# EAGLE schematic civ_if1 (EAGLE 7.7.0)
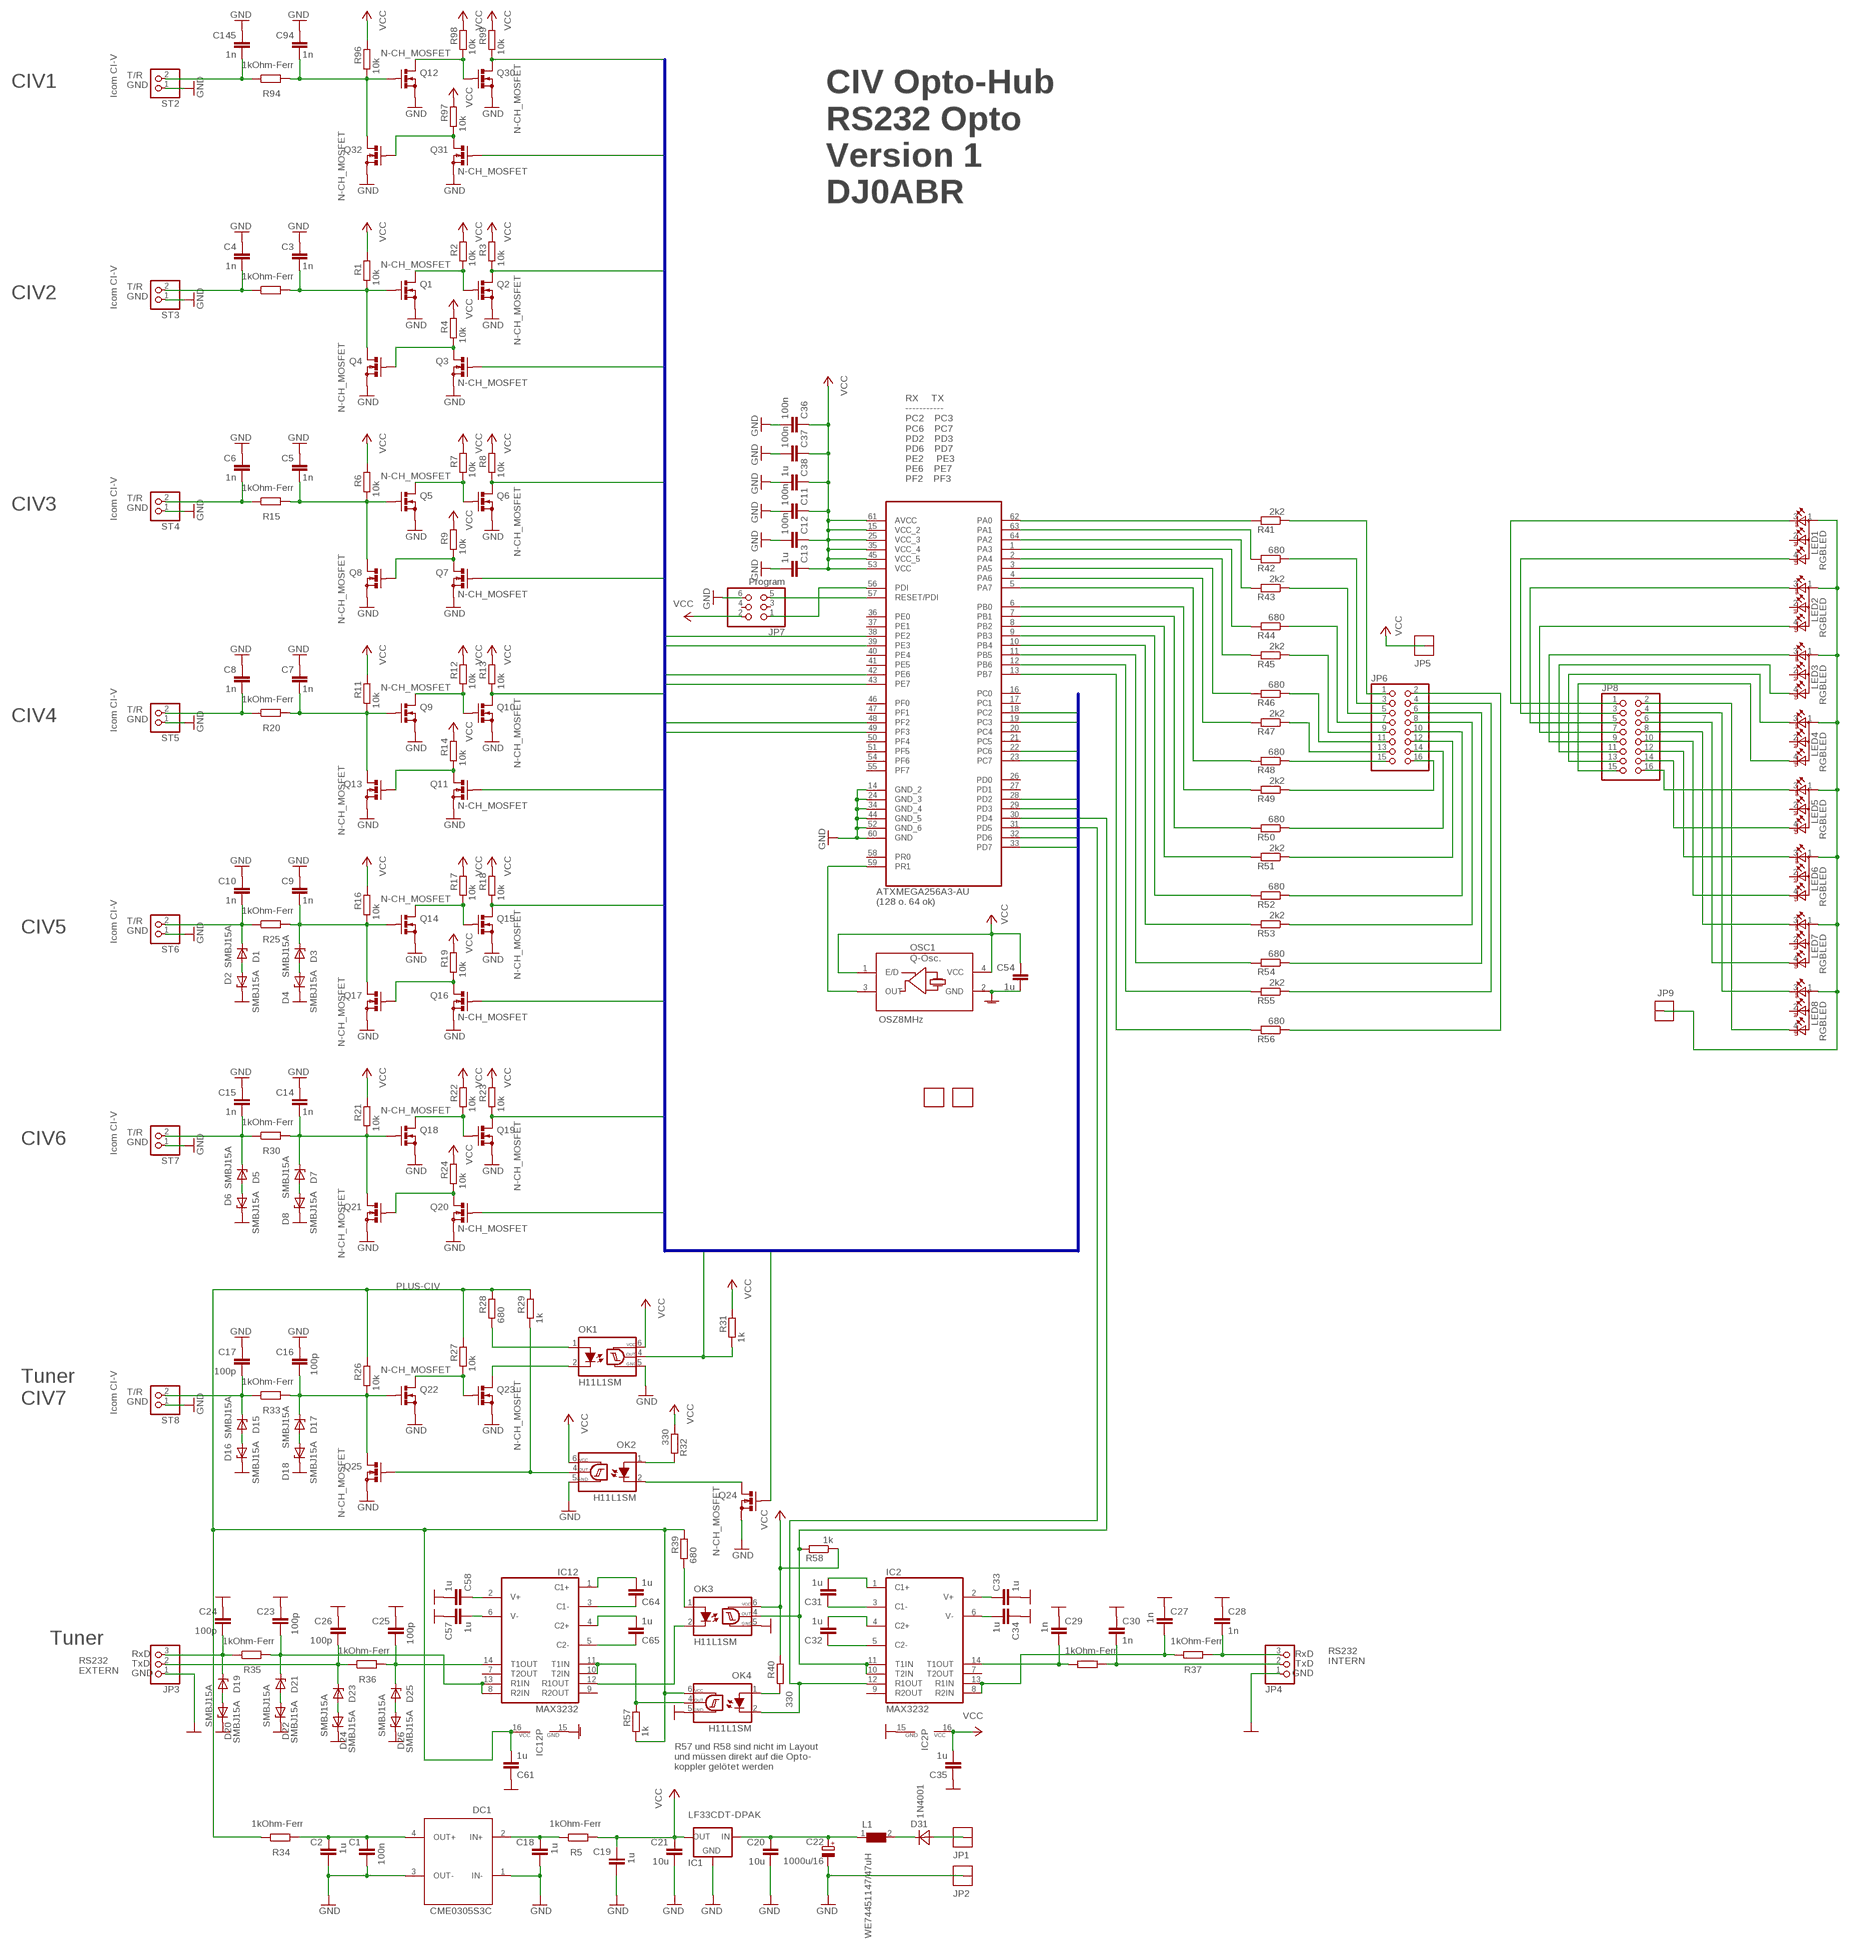
[diagram p0: schematic, sheet 1]

## Parts
C1  100n  C-EUC0603  [C0603]
C2  1u  C-EUC0603  [C0603]
C3  1n  C-EUC0603  [C0603]
C4  1n  C-EUC0603  [C0603]
C5  1n  C-EUC0603  [C0603]
C6  1n  C-EUC0603  [C0603]
C7  1n  C-EUC0603  [C0603]
C8  1n  C-EUC0603  [C0603]
C9  1n  C-EUC0603  [C0603]
C10  1n  C-EUC0603  [C0603]
C11  100n  C-EUC0603  [C0603]
C12  100n  C-EUC0603  [C0603]
C13  1u  C-EUC0603  [C0603]
C14  1n  C-EUC0603  [C0603]
C15  1n  C-EUC0603  [C0603]
C16  100p  C-EUC0603  [C0603]
C17  100p  C-EUC0603  [C0603]
C18  1u  C-EUC0603  [C0603]
C19  1u  C-EUC0603  [C0603]
C20  10u  C-EUC0805  [C0805]
C21  10u  C-EUC0603  [C0603]
C22  1000u/16  CPOL-EUE5-13  [E5-13]
C23  100p  C-EUC0603  [C0603]
C24  100p  C-EUC0603  [C0603]
C25  100p  C-EUC0603  [C0603]
C26  100p  C-EUC0603  [C0603]
C27  1n  C-EUC0603  [C0603]
C28  1n  C-EUC0603  [C0603]
C29  1n  C-EUC0603  [C0603]
C30  1n  C-EUC0603  [C0603]
C31  1u  C-EUC0603K  [C0603K]
C32  1u  C-EUC0603K  [C0603K]
C33  1u  C-EUC0603K  [C0603K]
C34  1u  C-EUC0603K  [C0603K]
C35  1u  C-EUC0603  [C0603]
C36  100n  C-EUC0603  [C0603]
C37  100n  C-EUC0603  [C0603]
C38  1u  C-EUC0603  [C0603]
C54  1u  C-EUC0603K  [C0603K]
C57  1u  C-EUC0603K  [C0603K]
C58  1u  C-EUC0603K  [C0603K]
C61  1u  C-EUC0603  [C0603]
C64  1u  C-EUC0603K  [C0603K]
C65  1u  C-EUC0603K  [C0603K]
C94  1n  C-EUC0603  [C0603]
C145  1n  C-EUC0603  [C0603]
D1  SMBJ15A  ZPYSMA  [SMA]
D2  SMBJ15A  ZPYSMA  [SMA]
D3  SMBJ15A  ZPYSMA  [SMA]
D4  SMBJ15A  ZPYSMA  [SMA]
D5  SMBJ15A  ZPYSMA  [SMA]
D6  SMBJ15A  ZPYSMA  [SMA]
D7  SMBJ15A  ZPYSMA  [SMA]
D8  SMBJ15A  ZPYSMA  [SMA]
D15  SMBJ15A  ZPYSMA  [SMA]
D16  SMBJ15A  ZPYSMA  [SMA]
D17  SMBJ15A  ZPYSMA  [SMA]
D18  SMBJ15A  ZPYSMA  [SMA]
D19  SMBJ15A  ZPYSMA  [SMA]
D20  SMBJ15A  ZPYSMA  [SMA]
D21  SMBJ15A  ZPYSMA  [SMA]
D22  SMBJ15A  ZPYSMA  [SMA]
D23  SMBJ15A  ZPYSMA  [SMA]
D24  SMBJ15A  ZPYSMA  [SMA]
D25  SMBJ15A  ZPYSMA  [SMA]
D26  SMBJ15A  ZPYSMA  [SMA]
D31  1N4001  DIODE_GROSSSMD  [MELF]
DC1  CME0305S3C  CME_MURATA_DCDCCME  [MURATA_DCDC]
FID1  FIDUCIAL  [FIDUCIAL]
FID2  FIDUCIAL  [FIDUCIAL]
IC1  LF33CDT-DPAK  LP2950CDT-5.0  [DPACK]
IC2  MAX3232  MAX3232CSE  [SO16]
IC12  MAX3232  MAX3232CSE  [SO16]
JP1  THICKPINSQUARE  [THICKPIN]
JP2  THICKPINSQUARE  [THICKPIN]
JP3  PINHD-1X3  [1X03]
JP4  PINHD-1X3  [1X03]
JP5  THICKPINSQUARE  [THICKPIN]
JP6  PINHD-2X8  [2X08]
JP7  Program  PINHD-2X3  [2X03]
JP8  PINHD-2X8  [2X08]
JP9  THICKPINSQUARE  [THICKPIN]
L1  WE74451147/47uH  WE-PD3-74451147_S  [S]
LED1  RGBLED  LED_RGB_WE  [PLCC4_WE_LED]
LED2  RGBLED  LED_RGB_WE  [PLCC4_WE_LED]
LED3  RGBLED  LED_RGB_WE  [PLCC4_WE_LED]
LED4  RGBLED  LED_RGB_WE  [PLCC4_WE_LED]
LED5  RGBLED  LED_RGB_WE  [PLCC4_WE_LED]
LED6  RGBLED  LED_RGB_WE  [PLCC4_WE_LED]
LED7  RGBLED  LED_RGB_WE  [PLCC4_WE_LED]
LED8  RGBLED  LED_RGB_WE  [PLCC4_WE_LED]
OK1  H11L1SM  H11L1MS  [DIL6-SMD]
OK2  H11L1SM  H11L1MS  [DIL6-SMD]
OK3  H11L1SM  H11L1MS  [DIL6-SMD]
OK4  H11L1SM  H11L1MS  [DIL6-SMD]
OSC1  OSZ8MHz  QOSC_AURELAURIS7050  [QOSC_AQO7015]
Q1  N-CH_MOSFET  BS170_SMD  [SOT23]
Q2  N-CH_MOSFET  BS170_SMD  [SOT23]
Q3  N-CH_MOSFET  BS170_SMD  [SOT23]
Q4  N-CH_MOSFET  BS170_SMD  [SOT23]
Q5  N-CH_MOSFET  BS170_SMD  [SOT23]
Q6  N-CH_MOSFET  BS170_SMD  [SOT23]
Q7  N-CH_MOSFET  BS170_SMD  [SOT23]
Q8  N-CH_MOSFET  BS170_SMD  [SOT23]
Q9  N-CH_MOSFET  BS170_SMD  [SOT23]
Q10  N-CH_MOSFET  BS170_SMD  [SOT23]
Q11  N-CH_MOSFET  BS170_SMD  [SOT23]
Q12  N-CH_MOSFET  BS170_SMD  [SOT23]
Q13  N-CH_MOSFET  BS170_SMD  [SOT23]
Q14  N-CH_MOSFET  BS170_SMD  [SOT23]
Q15  N-CH_MOSFET  BS170_SMD  [SOT23]
Q16  N-CH_MOSFET  BS170_SMD  [SOT23]
Q17  N-CH_MOSFET  BS170_SMD  [SOT23]
Q18  N-CH_MOSFET  BS170_SMD  [SOT23]
Q19  N-CH_MOSFET  BS170_SMD  [SOT23]
Q20  N-CH_MOSFET  BS170_SMD  [SOT23]
Q21  N-CH_MOSFET  BS170_SMD  [SOT23]
Q22  N-CH_MOSFET  BS170_SMD  [SOT23]
Q23  N-CH_MOSFET  BS170_SMD  [SOT23]
Q24  N-CH_MOSFET  BS170_SMD  [SOT23]
Q25  N-CH_MOSFET  BS170_SMD  [SOT23]
Q30  N-CH_MOSFET  BS170_SMD  [SOT23]
Q31  N-CH_MOSFET  BS170_SMD  [SOT23]
Q32  N-CH_MOSFET  BS170_SMD  [SOT23]
R1  10k  R-EU_R0603  [R0603]
R2  10k  R-EU_R0603  [R0603]
R3  10k  R-EU_R0603  [R0603]
R4  10k  R-EU_R0603  [R0603]
R5  1kOhm-Ferr  R-EU_R0603  [R0603]
R6  10k  R-EU_R0603  [R0603]
R7  10k  R-EU_R0603  [R0603]
R8  10k  R-EU_R0603  [R0603]
R9  10k  R-EU_R0603  [R0603]
R10  1kOhm-Ferr  R-EU_R0603  [R0603]
R11  10k  R-EU_R0603  [R0603]
R12  10k  R-EU_R0603  [R0603]
R13  10k  R-EU_R0603  [R0603]
R14  10k  R-EU_R0603  [R0603]
R15  1kOhm-Ferr  R-EU_R0603  [R0603]
R16  10k  R-EU_R0603  [R0603]
R17  10k  R-EU_R0603  [R0603]
R18  10k  R-EU_R0603  [R0603]
R19  10k  R-EU_R0603  [R0603]
R20  1kOhm-Ferr  R-EU_R0603  [R0603]
R21  10k  R-EU_R0603  [R0603]
R22  10k  R-EU_R0603  [R0603]
R23  10k  R-EU_R0603  [R0603]
R24  10k  R-EU_R0603  [R0603]
R25  1kOhm-Ferr  R-EU_R0603  [R0603]
R26  10k  R-EU_R0603  [R0603]
R27  10k  R-EU_R0603  [R0603]
R28  680  R-EU_R0603  [R0603]
R29  1k  R-EU_R0603  [R0603]
R30  1kOhm-Ferr  R-EU_R0603  [R0603]
R31  1k  R-EU_R0603  [R0603]
R32  330  R-EU_R0603  [R0603]
R33  1kOhm-Ferr  R-EU_R0603  [R0603]
R34  1kOhm-Ferr  R-EU_R0603  [R0603]
R35  1kOhm-Ferr  R-EU_R0603  [R0603]
R36  1kOhm-Ferr  R-EU_R0603  [R0603]
R37  1kOhm-Ferr  R-EU_R0603  [R0603]
R38  1kOhm-Ferr  R-EU_R0603  [R0603]
R39  680  R-EU_R0603  [R0603]
R40  330  R-EU_R0603  [R0603]
R41  2k2  R-EU_R0603  [R0603]
R42  680  R-EU_R0603  [R0603]
R43  2k2  R-EU_R0603  [R0603]
R44  680  R-EU_R0603  [R0603]
R45  2k2  R-EU_R0603  [R0603]
R46  680  R-EU_R0603  [R0603]
R47  2k2  R-EU_R0603  [R0603]
R48  680  R-EU_R0603  [R0603]
R49  2k2  R-EU_R0603  [R0603]
R50  680  R-EU_R0603  [R0603]
R51  2k2  R-EU_R0603  [R0603]
R52  680  R-EU_R0603  [R0603]
R53  2k2  R-EU_R0603  [R0603]
R54  680  R-EU_R0603  [R0603]
R55  2k2  R-EU_R0603  [R0603]
R56  680  R-EU_R0603  [R0603]
R57  1k  R-EU_R0603  [R0603]
R58  1k  R-EU_R0603  [R0603]
R94  1kOhm-Ferr  R-EU_R0603  [R0603]
R96  10k  R-EU_R0603  [R0603]
R97  10k  R-EU_R0603  [R0603]
R98  10k  R-EU_R0603  [R0603]
R99  10k  R-EU_R0603  [R0603]
ST2  PINHEAD2X1SMALL  [PINHEAD1X2]
ST3  PINHEAD2X1SMALL  [PINHEAD1X2]
ST4  PINHEAD2X1SMALL  [PINHEAD1X2]
ST5  PINHEAD2X1SMALL  [PINHEAD1X2]
ST6  PINHEAD2X1SMALL  [PINHEAD1X2]
ST7  PINHEAD2X1SMALL  [PINHEAD1X2]
ST8  PINHEAD2X1SMALL  [PINHEAD1X2]
U1  ATXMEGA256A3-AU  [QFP80P1600X1600X120-64N]

## Nets
GND [Supply]: C1.2 C2.2 C3.1 C4.1 C5.1 C6.1 C7.1 C8.1 C9.1 C10.1 C11.2 C12.2 C13.2 C14.1 C15.1 C16.1 C17.1 C18.2 C19.2 C20.2 C21.2 C22.- C23.1 C24.1 C25.1 C26.1 C27.1 C28.1 C29.1 C30.1 C33.2 C34.1 C35.1 C36.2 C37.2 C38.2 C54.2 C57.1 C58.2 C61.1 C94.1 C145.1 D2.C D4.C D6.C D8.C D16.C D18.C D20.C D22.C D24.C D26.C DC1.1(IN-) DC1.3(OUT-) IC1.4(GND) IC2.15(GND) IC12.15(GND) JP2.1 JP3.1 JP4.1 JP7.6 OK1.5(GND) OK2.5(GND) OK3.5(GND) OK4.5(GND) OSC1.2(GND) Q1.2(S) Q2.2(S) Q3.2(S) Q4.2(S) Q5.2(S) Q6.2(S) Q7.2(S) Q8.2(S) Q9.2(S) Q10.2(S) Q11.2(S) Q12.2(S) Q13.2(S) Q14.2(S) Q15.2(S) Q16.2(S) Q17.2(S) Q18.2(S) Q19.2(S) Q20.2(S) Q21.2(S) Q22.2(S) Q23.2(S) Q24.2(S) Q25.2(S) Q30.2(S) Q31.2(S) Q32.2(S) ST2.1 ST3.1 ST4.1 ST5.1 ST6.1 ST7.1 ST8.1 U1.14(GND_2) U1.24(GND_3) U1.34(GND_4) U1.44(GND_5) U1.52(GND_6) U1.60(GND) ; supply symbol labelled 
N$1: OK1.2(C) Q23.3(D)
N$2: Q1.3(D) Q2.1(G) R2.1
N$3: OSC1.3(OUT) U1.59(PR1)
N$4: C1.1 C2.1 DC1.4(OUT+) R34.2
N$5: Q3.3(D) Q4.1(G) R4.1
N$6: C18.1 DC1.2(IN+) R5.1
N$7: C4.2 R10.1 ST3.2
N$8: OK2.1(A) R32.2
N$9: Q5.3(D) Q6.1(G) R7.1
N$10: C94.2 Q12.1(G) Q32.3(D) R94.2 R96.1
N$11: C3.2 Q1.1(G) Q4.3(D) R1.1 R10.2
N$12: Q7.3(D) Q8.1(G) R9.1
N$13: C6.2 R15.1 ST4.2
N$14: C5.2 Q5.1(G) Q8.3(D) R6.1 R15.2
N$15: C8.2 R20.1 ST5.2
N$16: Q9.3(D) Q10.1(G) R12.1
N$17: Q22.3(D) Q23.1(G) R27.1
N$18: OK2.4(OUT) Q25.1(G) R29.1
N$19: Q11.3(D) Q13.1(G) R14.1
N$20 [v12]: C20.1 C22.+ IC1.1(IN) L1.1
N$21: C7.2 Q9.1(G) Q13.3(D) R11.1 R20.2
N$22: C10.2 D1.C R25.1 ST6.2
N$23: Q14.3(D) Q15.1(G) R17.1
N$24: C9.2 D3.C Q14.1(G) Q17.3(D) R16.1 R25.2
N$25: C15.2 D5.C R30.1 ST7.2
N$26: Q16.3(D) Q17.1(G) R19.1
N$27: JP6.1 R41.1
N$28: C14.2 D7.C Q18.1(G) Q21.3(D) R21.1 R30.2
N$29: C17.2 D15.C R33.1 ST8.2
N$30: Q18.3(D) Q19.1(G) R22.1
N$31: C16.2 D17.C Q22.1(G) Q25.3(D) R26.1 R33.2
N$32: JP6.3 R42.1
N$33: Q20.3(D) Q21.1(G) R24.1
N$34 [Supply]: D31.2(A) JP1.1
N$35: D15.A D16.A
N$36: D17.A D18.A
N$37: C24.2 D19.C JP3.3 R35.1
N$38: C23.2 D21.C IC12.8(R2IN) IC12.13(R1IN) R35.2
N$39: D19.A D20.A
N$40: D21.A D22.A
N$41: C26.2 D23.C JP3.2 R36.1
N$42: C28.2 JP4.3 R37.1
N$43: D23.A D24.A
N$44: D25.A D26.A
N$45: C64.1 IC12.3(C1-)
N$46: C64.2 IC12.1(C1+)
N$47: C65.2 IC12.4(C2+)
N$48: C65.1 IC12.5(C2-)
N$49: C58.1 IC12.2(V+)
N$50: C57.2 IC12.6(V-)
N$51: IC12.10(T2IN) IC12.11(T1IN) OK4.4(OUT) R57.2
N$52: IC12.12(R1OUT) OK3.2(C)
N$53: C27.2 IC2.8(R2IN) IC2.13(R1IN) R37.2
N$54: C25.2 D25.C IC12.14(T1OUT) R36.2
N$55: JP6.5 R43.1
N$56: JP6.7 R44.1
N$57: C30.2 JP4.2 R38.1
N$58: JP6.9 R45.1
N$59: JP6.11 R46.1
N$60: C31.1 IC2.3(C1-)
N$61: C31.2 IC2.1(C1+)
N$62: C32.2 IC2.4(C2+)
N$63: C32.1 IC2.5(C2-)
N$64: C33.1 IC2.2(V+)
N$65: C34.2 IC2.6(V-)
N$66: IC2.10(T2IN) IC2.11(T1IN) OK3.4(OUT) R58.2 U1.30(PD4)
N$67: IC2.12(R1OUT) OK4.2(C) U1.31(PD5)
N$68: C29.2 IC2.14(T1OUT) R38.2
N$69: JP6.13 R47.1
N$70: OK3.1(A) R39.1
N$71: OK4.1(A) R40.1
N$72: JP6.15 R48.1
N$73: JP6.16 R49.1
N$74: JP6.14 R50.1
N$75: JP6.12 R51.1
N$76: JP6.10 R52.1
N$77: JP6.8 R53.1
N$78: JP6.6 R54.1
N$79: JP6.4 R55.1
N$80: JP6.2 R56.1
N$81: R41.2 U1.62(PA0)
N$82: R42.2 U1.63(PA1)
N$83: R43.2 U1.64(PA2)
N$84: R44.2 U1.1(PA3)
N$85: R45.2 U1.2(PA4)
N$86: R46.2 U1.3(PA5)
N$87: R47.2 U1.4(PA6)
N$88: R48.2 U1.5(PA7)
N$89: R49.2 U1.6(PB0)
N$90: R50.2 U1.7(PB1)
N$91: R51.2 U1.8(PB2)
N$92: R52.2 U1.9(PB3)
N$93: R53.2 U1.10(PB4)
N$94: R54.2 U1.11(PB5)
N$95 [v12]: D31.1(C) L1.2
N$96: R55.2 U1.12(PB6)
N$97: R56.2 U1.13(PB7)
N$98: D1.A D2.A
N$99: Q12.3(D) Q30.1(G) R98.1
N$100: JP7.5 U1.57(RESET/PDI)
N$101: JP7.1 U1.56(PDI)
N$102: D3.A D4.A
N$103: D5.A D6.A
N$104: D7.A D8.A
N$105: Q31.3(D) Q32.1(G) R97.1
N$106: C145.2 R94.1 ST2.2
N$107: OK2.2(C) Q24.3(D)
N$108: JP9.1 LED1.1(A2) LED2.1(A2) LED3.1(A2) LED4.1(A2) LED5.1(A2) LED6.1(A2) LED7.1(A2) LED8.1(A2)
N$109: JP8.1 LED1.3(CRED)
N$110: JP8.3 LED1.4(CGREEN)
N$111: JP8.5 LED2.3(CRED)
N$112: JP8.7 LED2.4(CGREEN)
N$113: JP8.9 LED3.3(CRED)
N$114: JP8.11 LED3.4(CGREEN)
N$115: JP8.13 LED4.3(CRED)
N$116: JP8.15 LED4.4(CGREEN)
N$117: JP8.16 LED5.3(CRED)
N$118: JP8.14 LED5.4(CGREEN)
N$119: JP8.12 LED6.3(CRED)
N$120: JP8.10 LED6.4(CGREEN)
N$121: JP8.8 LED7.3(CRED)
N$122: JP8.6 LED7.4(CGREEN)
N$123: JP8.4 LED8.3(CRED)
N$124: JP8.2 LED8.4(CGREEN)
PLUS-CIV [Supply]: C61.2 IC12.16(VCC) OK4.6(VCC) R26.2 R27.2 R28.2 R29.2 R34.1 R39.2 R57.1
UART1: Q30.3(D) R99.1 U1.18(PC2)
UART2: Q31.1(G) U1.19(PC3)
UART3: Q2.3(D) R3.1 U1.22(PC6)
UART4: Q3.1(G) U1.23(PC7)
UART5: Q6.3(D) R8.1 U1.28(PD2)
UART6: Q7.1(G) U1.29(PD3)
UART7: Q10.3(D) R13.1 U1.32(PD6)
UART8: Q11.1(G) U1.33(PD7)
UART9: Q15.3(D) R18.1 U1.38(PE2)
UART10: Q16.1(G) U1.39(PE3)
UART11: Q19.3(D) R23.1 U1.42(PE6)
UART12: Q20.1(G) U1.43(PE7)
UART13: OK1.4(OUT) R31.1 U1.48(PF2)
UART14: Q24.1(G) U1.49(PF3)
UART15: OK1.1(A) R28.1
VCC [Supply]: C11.1 C12.1 C13.1 C19.1 C21.1 C35.2 C36.1 C37.1 C38.1 C54.1 IC1.3(OUT) IC2.16(VCC) JP5.1 JP7.2 OK1.6(VCC) OK2.6(VCC) OK3.6(VCC) OSC1.1(E/D) OSC1.4(VCC) R1.2 R2.2 R3.2 R4.2 R5.2 R6.2 R7.2 R8.2 R9.2 R11.2 R12.2 R13.2 R14.2 R16.2 R17.2 R18.2 R19.2 R21.2 R22.2 R23.2 R24.2 R31.2 R32.1 R40.2 R58.1 R96.2 R97.2 R98.2 R99.2 U1.15(VCC_2) U1.25(VCC_3) U1.35(VCC_4) U1.45(VCC_5) U1.53(VCC) U1.61(AVCC)
Unconnected: FID1.P$1 FID2.P$1 IC2.7(T2OUT) IC2.9(R2OUT) IC12.7(T2OUT) IC12.9(R2OUT) JP7.3 JP7.4 LED1.2(CBLUE) LED2.2(CBLUE) LED3.2(CBLUE) LED4.2(CBLUE) LED5.2(CBLUE) LED6.2(CBLUE) LED7.2(CBLUE) LED8.2(CBLUE) U1.16(PC0) U1.17(PC1) U1.20(PC4) U1.21(PC5) U1.26(PD0) U1.27(PD1) U1.36(PE0) U1.37(PE1) U1.40(PE4) U1.41(PE5) U1.46(PF0) U1.47(PF1) U1.50(PF4) U1.51(PF5) U1.54(PF6) U1.55(PF7) U1.58(PR0)

## Buses
UART[1..14]

## Notes on the sheet
- T/R
- CIV1 | GND
- Icom CI-V
- CIV Opto-Hub
  RS232 Opto
  Version 1
  DJ0ABR
- T/R
- CIV2 | GND
- Icom CI-V
- RX     TX
  -----------
  PC2    PC3
  PC6    PC7
  PD2    PD3
  PD6    PD7 
  PE2     PE3
  PE6    PE7
  PF2    PF3
- T/R
- CIV3 | GND
- Icom CI-V
- T/R
- CIV4 | GND
- Icom CI-V
- ATXMEGA256A3-AU
  (128 o. 64 ok)
- T/R
- CIV5 | GND
- Icom CI-V
- T/R
- CIV6 | GND
- Icom CI-V
- T/R
- Tuner
  CIV7
- GND
- Icom CI-V
- Tuner
- RxD | RxD
- RS232
  INTERN
- TxD | TxD
- RS232
  EXTERN
- GND | GND
- R57 und R58 sind nicht im Layout
  und müssen direkt auf die Opto-
  koppler gelötet werden

## Library data of the parts
C1-C21 C23-C38 C54 C57 C58 C61 C64 C65 C94 C145 = rcl:C-EU: CAPACITOR, European symbol
C22 = rcl:CPOL-EU: POLARIZED CAPACITOR, European symbol
D1-D8 D15-D26 = km:ZPY: Z DIODE 1 W
D31 = km:DIODE_GROSS
DC1 = km:CME_MURATA_DCDC
FID1 FID2 = km:FIDUCIAL
IC1 = v-reg:LP2950?*: Source: http://cache.national.com/ds/LP/LP2950.pdf
IC2 IC12 = maxim:MAX3232*: True RS-232 Transceivers 3.0V to 5.5V, Low-Power up to 1Mbps, Using Four 0.1µF External Capacitors Source: http://pdfserv.maxim-ic.com/en/ds/MAX3222-MAX3241.pdf; MPN: MAX3232CSE; OC_FARNELL: 9725490; OC_NEWARK: 90C2890
JP1 JP2 JP5 JP9 = km:THICKPIN
JP3 JP4 = pinhead:PINHD-1X3: PIN HEADER
JP6 JP8 = pinhead:PINHD-2X8: PIN HEADER
JP7 = pinhead:PINHD-2X3: PIN HEADER
L1 = WE-PD3:WE-PD3: SMD-Shielded Power Inductor WE-PD3 - Magnetically shielded version which results in a low leakage field - High storage capacity - Low inherent-losses - Extremely low profile of type M: 2,7mm -- Is recommended for the application with switching regulators from National Semiconductor, Linear Technology, Texas Instruments and Fairchild Semiconductor -- EMI filter -- Perfectly suitable for switching regulators with extremely high efficiency; MPN: 74451147; OC_FARNELL: 1636065; OC_NEWARK: 08P2637; PACKAGE: Type S; SUPPLIER: Würth Elektronik eiSos GmbH
LED1-LED8 = km:LED_RGB_WE
OK1-OK4 = optocoupler:H11L*M: 6-Pin DIP Optocoupler Source: http://www.fairchildsemi.com/ds/H1/H11L2-M.pdf; OC_FARNELL: unknown; OC_NEWARK: unknown
OSC1 = km:QOSC_AUREL
Q1-Q25 Q30-Q32 = km:BS170_: N-CHANNEL MOS FET
R1-R58 R94 R96-R99 = rcl:R-EU_: RESISTOR, European symbol
ST2-ST8 = km:PINHEAD2X1
U1 = ATXMEGA256A3-AU:ATXMEGA256A3-AU; DESCRIPTION: MCU; MPN: ATXMEGA256A3-AU; OC_FARNELL: 1748554; OC_NEWARK: -; PACKAGE: QFP-64; SUPPLIER: Atmel

## Net classes
1 Supply: width 0.406 mm, drill 0.3 mm
2 v12: width 0.61 mm, drill 0.3 mm